# EasyEDA Pro project ProPrj_电力电子综合设计_2025-07-04.epro, board PCB1_2
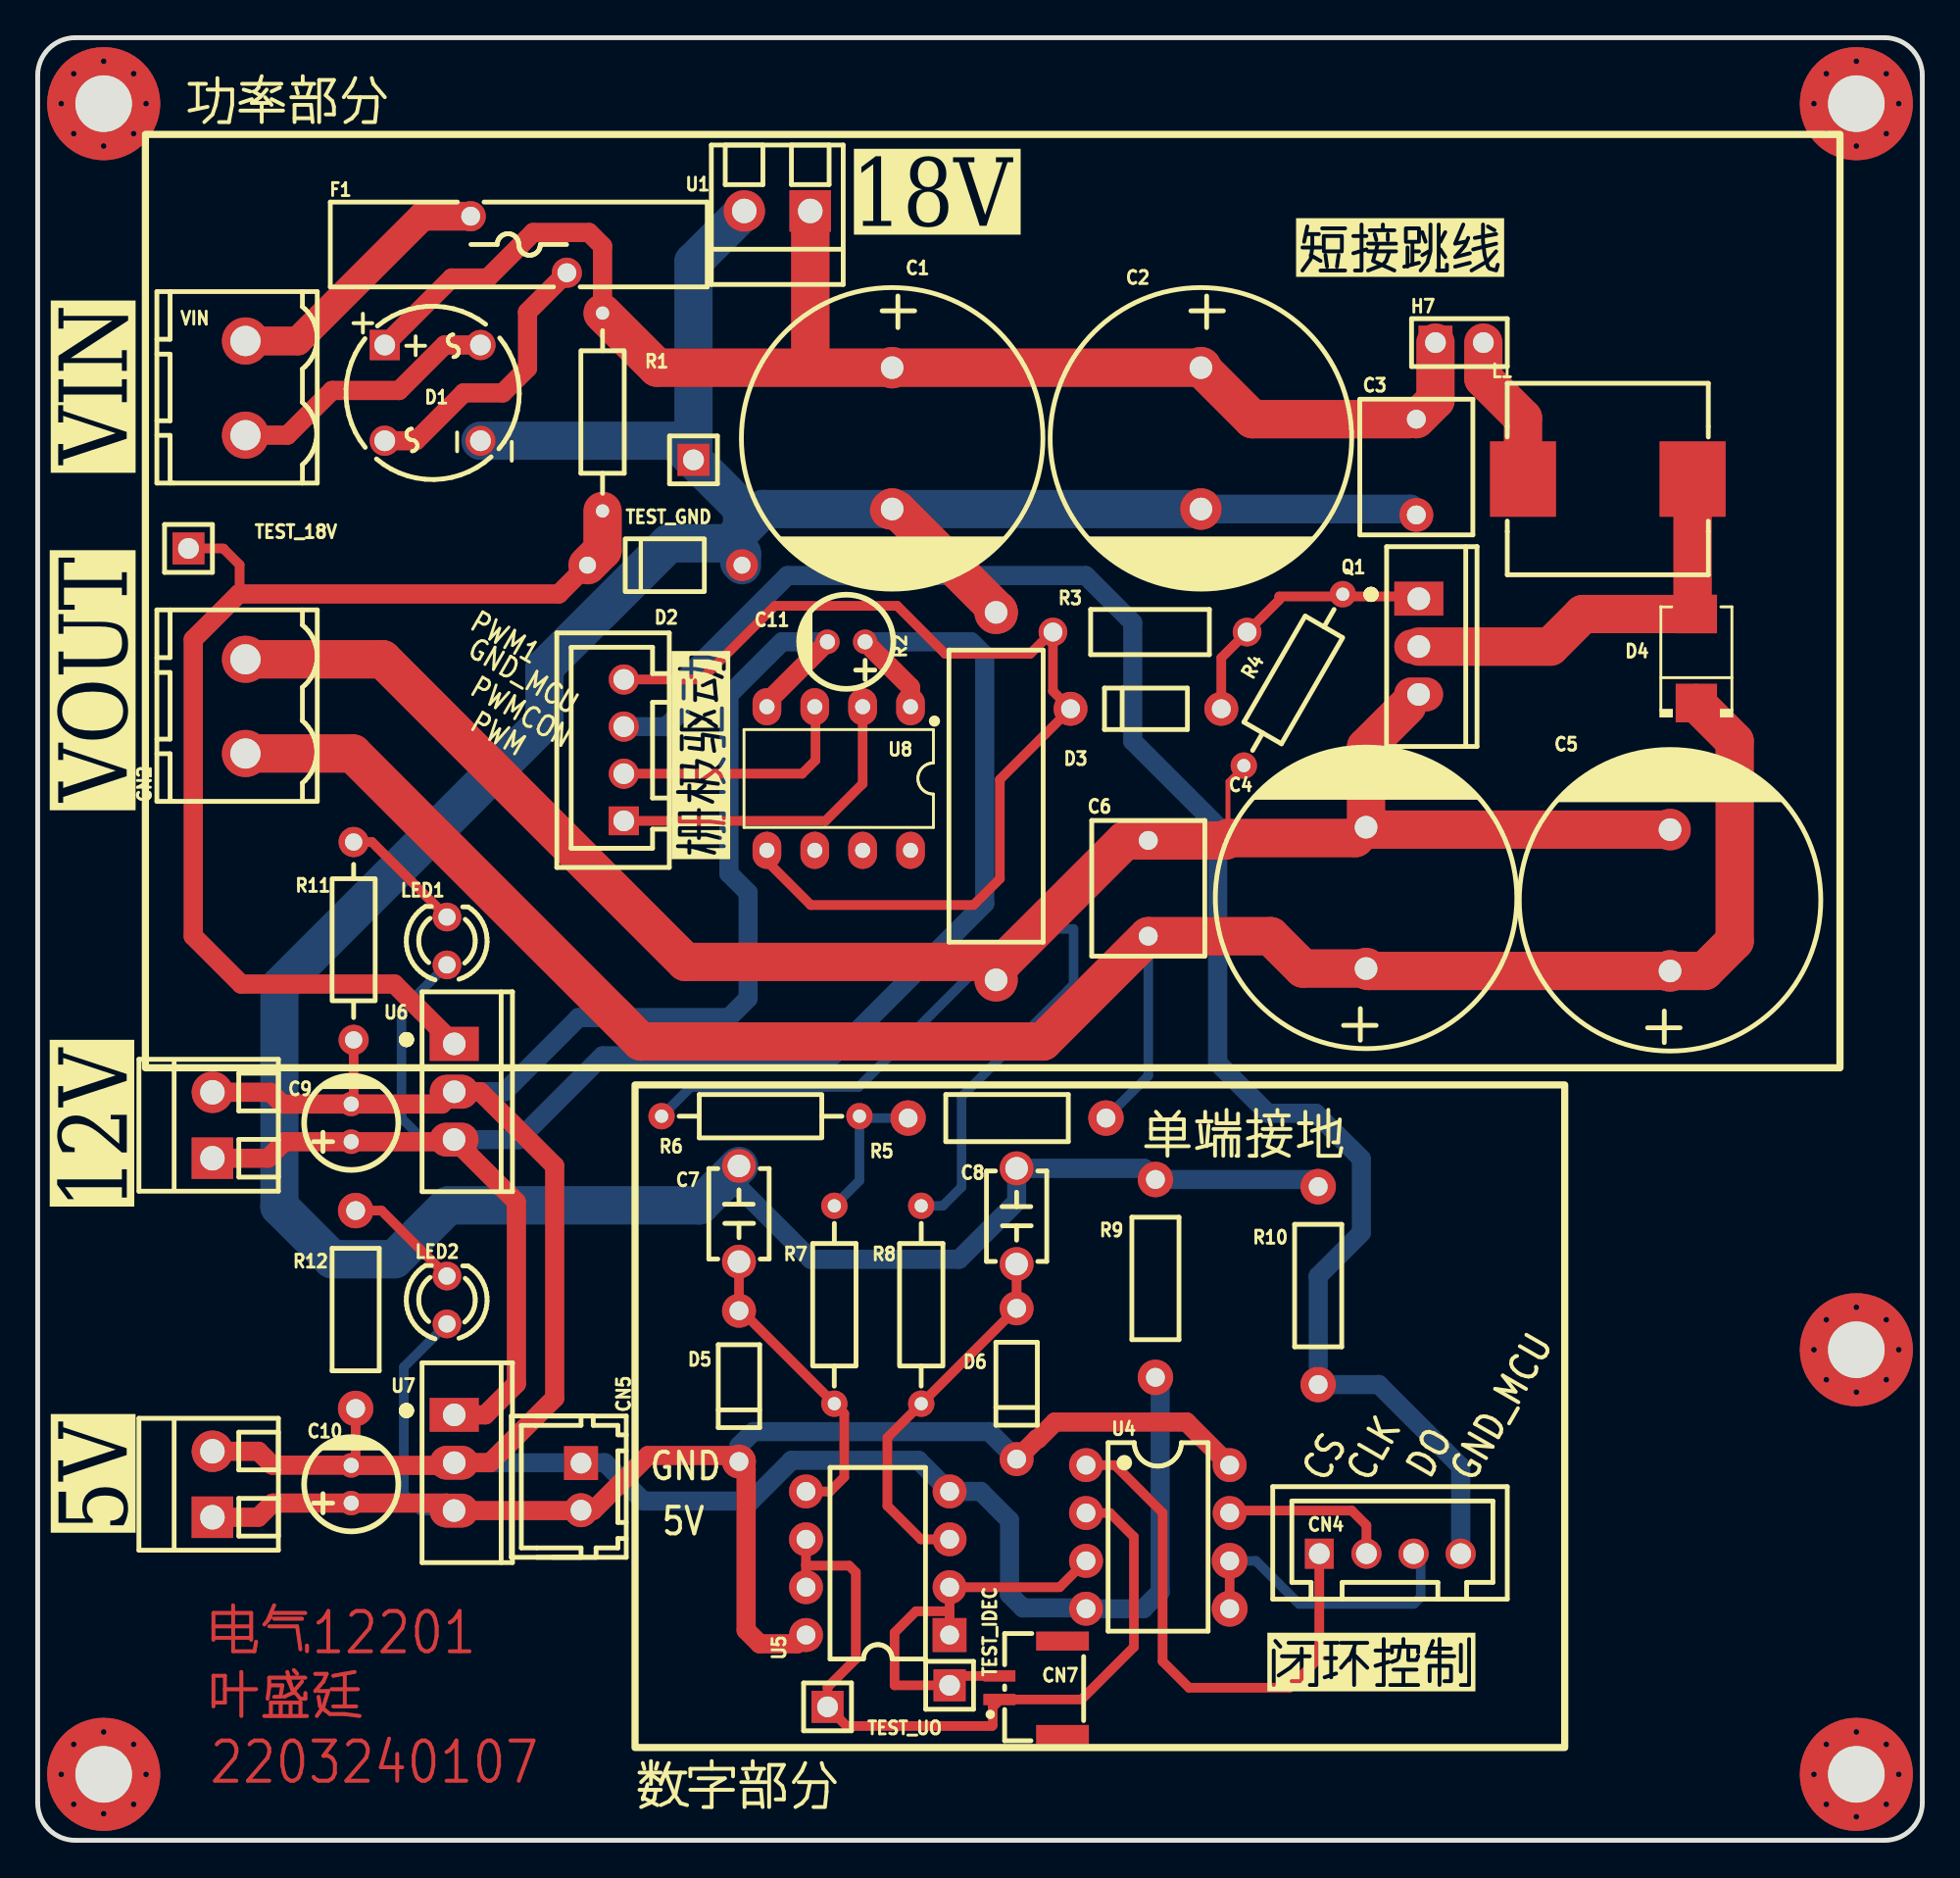
[diagram p7: board, top side]
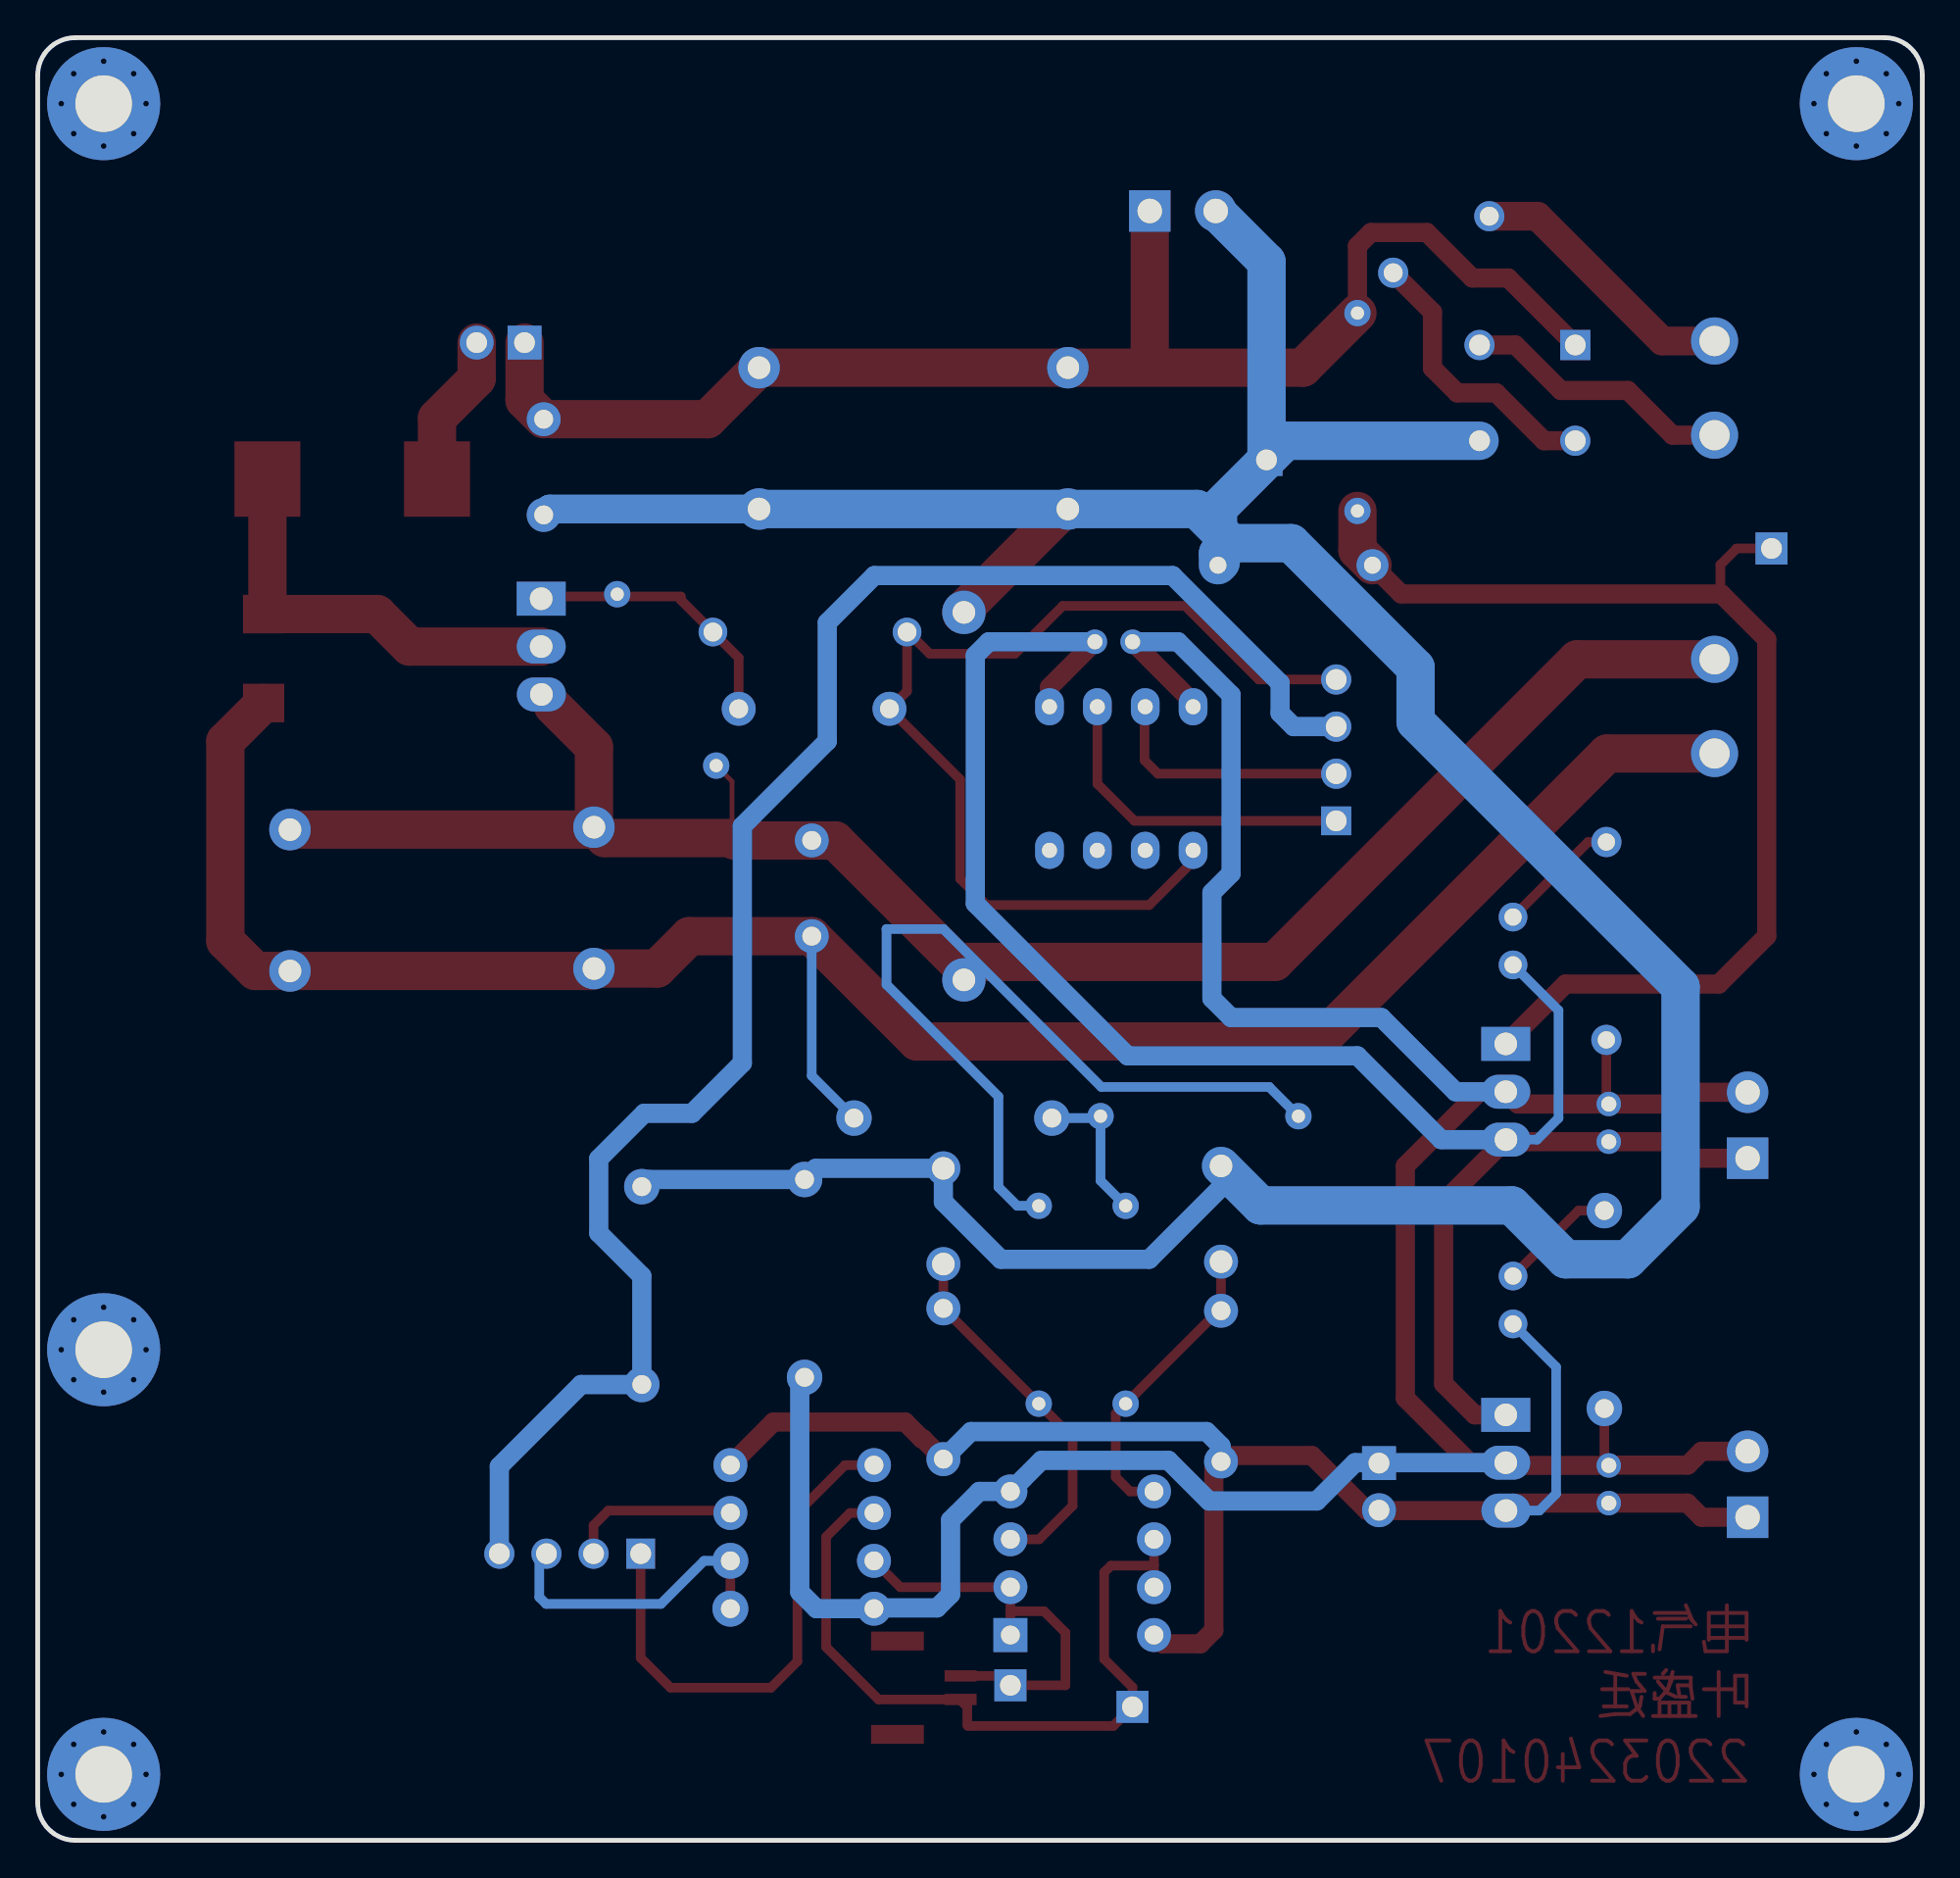
[diagram p8: board, bottom side, seen from below]

Outline 100 x 95.65 mm; copper layers: Top Layer, Bottom Layer. Coordinates in mm from the lower left corner of the outline.
Outline path: 0,93.65 0,2 arc(0.59,0.59) 2,0 98,0 arc(99.41,0.59) 100,2 100,93.65 arc(99.41,95.07) 98,95.65 2,95.65 arc(0.59,95.07) 0,93.65
Stack: Top Layer 0.035mm / Dielectric1 1.51mm FR4 er 4.5 / Bottom Layer 0.035mm

## Design rules (mm)
template: 自定义配置
spacing copperThickness1oz (default): track to track 0.102, other pairs 0.152 to 0.3
spacing copperThickness2oz: track to track 0.203, other pairs 0.152 to 0.3
track width copperThickness1oz (default): min 0.127, default 0.254, max 2.54
track width copperThickness2oz: min 0.203, default 0.254, max 2.54
differential pair differentialPair (default): width min 0.127, default 0.254, max 2.54; gap min 0.152, default 0.152
via viaSize (default): diameter min 0.406, default 0.406, max 10; hole min 0.305, default 0.305, max 6.299

## Placement (name value [footprint] x y rotation side)
C1  470uF  [CAP-TH_BD16.0-P7.50-D1.2-FD]  45.34 74.39 270 top
C2  470uF  [CAP-TH_BD16.0-P7.50-D1.2-FD]  61.72 74.39 270 top
C3  1uF  [CAP-TH_L7.2-W6.0-P5.00-D0.6]  73.15 72.87 90 top
C4  470uF  [CAP-TH_BD16.0-P7.50-D1.2-FD]  70.48 50.01 90 top
C5  470uF  [CAP-TH_BD16.0-P7.50-D1.2-FD]  86.61 49.88 90 top
C6  1uF  [CAP-TH_L7.2-W6.0-P5.00-D0.6]  58.93 50.52 270 top
C7  100nF  [CAP-TH_L4.8-W3.2-P5.08-D1.2]  37.21 33.24 270 top
C8  100nF  [CAP-TH_L4.8-W3.2-P5.08-D1.2]  51.94 33.12 270 top
C9  10uF  [CAP-TH_BD5.0-P2.00-D0.8-FD]  16.64 38.07 90 top
C10  10uF  [CAP-TH_BD5.0-P2.00-D0.8-FD]  16.64 18.89 90 top
C11  10uF  [CAP-TH_BD5.0-P2.00-D0.8-FD]  42.9 63.6 180 top
CN2  WJ2EDGV-5.08-2P  [CONN-TH_WJ2EDGV-5.08-2P]  11.02 60.17 90 top
CN3  ZX-XH2.54-4PZZ  [CONN-TH_4P-P2.50_4PIN]  31.1 57.85 90 top
CN4  ZX-XH2.54-4PZZ  [CONN-TH_4P-P2.50_4PIN]  71.75 15.21 0 top
CN5  ZX-XH2.54-2PZZ  [CONN-TH_2P-P2.50_HX25003-2A]  28.83 18.77 270 top
CN7  WAFER-GH1.25-2PLB  [CONN-TH_2P-P1.25_XUNPU_WAFER-GH1.25-2PLB]  52.7 8.1 90 top
D1  2W10  [DIO-BG-TH_2W10]  20.95 76.8 0 top
D2  1N4746APF-M  [DO-41_BD2.8-L4.2-P8.20-D0.7-RD]  33.27 67.66 0 top
D3  1N4148  [DO-35_BD2.0-L4.0-P8.00-D0.5-FD]  58.8 60.04 180 top
D4  SS310B  [SMB_L4.6-W3.6-LS5.3-RD]  88.01 62.71 90 top
D5  1N4148  [DO-35_BD2.0-L4.0-P8.00-D0.5-FD]  37.21 24.1 270 top
D6  1N4148  [DO-35_BD2.0-L4.0-P8.00-D0.5-FD]  51.94 24.23 270 top
F1  JK250-1000U  [FUSE-TH_L20.0-W4.5-P5.10-D0.8-S3.00]  25.53 84.68 0 top
H7  -  [HDR-TH_2P-P2.54-V-M-1]  75.44 79.47 0 top
L1  100uH  [IND-SMD_L10.6-W10.2]  83.31 72.23 0 top
LED1  204-10SUGD/S400-A5  [LED-TH_BD3.0-P2.54-FD-GREEN]  21.72 47.72 90 top
LED2  204-10SUGD/S400-A5  [LED-TH_BD3.0-P2.54-FD-GREEN]  21.72 28.67 90 top
NOREF  -  [Pad_e50]  96.5 92.15 270 top
NOREF#2  -  [Pad_e119]  3.5 3.5 90 top
NOREF#3  -  [Pad_e41]  3.5 92.15 0 top
NOREF#4  -  [Pad_e1739]  96.5 26.03 0 top
NOREF#5  -  [Pad_e109]  96.5 3.5 180 top
Q1  IRF540NPBF  [TO-220-3_L10.0-W4.5-P2.54-L]  73.28 63.34 270 top
R1  510Ω  [RES-TH_BD2.3-L6.5-P10.50-D0.5]  29.97 75.79 90 top
R2  100mΩ  [RES-TH_BD5.0-L15.5-P19.50-D0.7]  50.85 55.41 270 top
R3  10Ω  [RES-TH_BD2.4-L6.3-P10.30-D0.6]  59.02 64.11 0 top
R4  10kΩ  [RES-TH_BD2.3-L6.5-P10.50-D0.5]  66.62 61.57 60 top
R5  100kΩ  [RES-TH_BD2.5-L6.5-P10.50-D0.6]  51.44 38.32 0 top
R6  10kΩ  [RES-TH_BD2.3-L6.5-P10.50-D0.5]  38.35 38.42 0 top
R7  10kΩ  [RES-TH_BD2.3-L6.5-P10.50-D0.5]  42.27 28.42 270 top
R8  10kΩ  [RES-TH_BD2.3-L6.5-P10.50-D0.5]  46.88 28.42 270 top
R9  0Ω  [RES-TH_BD2.5-L6.5-P10.50-D0.6]  59.31 29.81 90 top
R10  0Ω  [RES-TH_BD2.5-L6.5-P10.50-D0.6]  67.94 29.43 270 top
R11  6.2kΩ  [RES-TH_BD2.2-L6.5-P10.50-D0.6]  16.76 47.72 90 top
R12  2.7kΩ  [RES-TH_BD2.5-L6.5-P10.50-D0.6]  16.87 28.16 90 top
TEST_18V  PZ254V-11-01P  [HDR-TH_1P-P2.54-V-M]  8 68.55 0 top
TEST_GND  PZ254V-11-01P  [HDR-TH_1P-P2.54-V-M]  34.8 73.25 0 top
TEST_IDEC  PZ254V-11-01P  [HDR-TH_1P-P2.54-V-M]  48.39 8.22 0 top
TEST_UO  PZ254V-11-01P  [HDR-TH_1P-P2.54-V-M]  41.91 7.08 0 top
U1  DB125-3.5-2P-GN-S  [CONN-TH_2P-P3.50_L7.4-W7.0]  39.24 86.46 180 top
U4  ADC0832CCN/NOPB  [PDIP-8_L9.6-W6.4-P2.54-LS7.6-BL]  59.44 16.1 270 top
U5  LM358AP  [DIP-8_L9.7-W6.4-P2.54-LS7.6-BL]  44.58 14.7 90 top
U6  L7812CV  [TO-220-3_L10.0-W4.5-P2.54-L]  22.1 39.72 270 top
U7  L7805CV  [TO-220-3_L10.0-W4.5-P2.54-L]  22.1 20.04 270 top
U8  IR2104PBF  [DIP-8_L9.9-W6.6-P2.54-LS7.62-BL]  42.5 56.34 180 top
U9  DB125-3.5-2P-GN-S  [CONN-TH_2P-P3.50_L7.4-W7.0]  9.27 37.94 90 top
U10  DB125-3.5-2P-GN-S  [CONN-TH_2P-P3.50_L7.4-W7.0]  9.27 18.89 90 top
VIN  WJ2EDGV-5.08-2P  [CONN-TH_WJ2EDGV-5.08-2P]  11.02 77.06 90 top

## Footprints (pads in the part's own frame, mm; a bottom-side part is the same pattern mirrored in y, then rotated)
CAP-TH_BD5.0-P2.00-D0.8-FD
  round 1.3 hole 0.8: 1(-1,0) 2(1,0)
CAP-TH_BD16.0-P7.50-D1.2-FD
  round 2.2 hole 1.2: 1(-3.75,0) 2(3.75,0)
CAP-TH_L4.8-W3.2-P5.08-D1.2
  round 1.8 hole 1.2: 1(-2.54,0) 2(2.54,0)
CAP-TH_L7.2-W6.0-P5.00-D0.6
  round 1.8 hole 1: 1(-2.54,0) 2(2.54,0)
CONN-TH_2P-P1.25_XUNPU_WAFER-GH1.25-2PLB
  rect 0.6x1.7 smd: 1(-0.625,1.675) 2(0.625,1.675)
  rect 1x2.8 smd: 3(2.475,-1.675) 4(-2.475,-1.675)
CONN-TH_2P-P2.50_HX25003-2A
  rect 1.8x1.8 hole 1.1: 1(-1.25,0)
  round 1.8 hole 1.1: 2(1.25,0)
CONN-TH_2P-P3.50_L7.4-W7.0
  rect 2.2x2.2 hole 1.3: 1(-1.75,0)
  round 2.2 hole 1.3: 2(1.75,0)
CONN-TH_4P-P2.50_4PIN
  rect 1.524x1.6 hole 1.1: 1(-3.75,0)
  round 1.6 hole 1.1: 2(-1.25,0) 3(1.25,0) 4(3.75,0)
CONN-TH_WJ2EDGV-5.08-2P
  round 2.5 hole 1.6: 1(-2.499,0) 2(2.499,0)
DIO-BG-TH_2W10
  rect 1.6x1.6 hole 1.1: 1(-2.54,2.54)
  round 1.6 hole 1.1: 2(-2.54,-2.54) 3(2.54,-2.54) 4(2.54,2.54)
DIP-8_L9.7-W6.4-P2.54-LS7.6-BL
  rect 1.8x1.8 hole 1: 1(-3.81,-3.81)
  round 1.8 hole 1: 2(-1.27,-3.81) 3(1.27,-3.81) 4(3.81,-3.81) 5(3.81,3.81) 6(1.27,3.81) 7(-1.27,3.81) 8(-3.81,3.81)
DIP-8_L9.9-W6.6-P2.54-LS7.62-BL
  oval 1.524x1.97 hole 0.8: 1(-3.81,-3.81) 2(-1.27,-3.81) 3(1.27,-3.81) 4(3.81,-3.81) 5(3.81,3.81) 6(1.27,3.81) 7(-1.27,3.81) 8(-3.81,3.81)
DO-35_BD2.0-L4.0-P8.00-D0.5-FD
  round 1.8 hole 1: 1(-4,0) 2(4,0)
DO-41_BD2.8-L4.2-P8.20-D0.7-RD
  round 1.7 hole 0.9: 1(-4.1,0) 2(4.1,0)
FUSE-TH_L20.0-W4.5-P5.10-D0.8-S3.00
  round 1.6 hole 1: 1(-2.55,1.5) 2(2.55,-1.5)
HDR-TH_1P-P2.54-V-M
  rect 1.7x1.7 hole 1.1: 1(0,0)
HDR-TH_2P-P2.54-V-M-1
  rect 1.8x1.8 hole 1.1: 1(-1.27,0)
  round 1.8 hole 1.1: 2(1.27,0)
IND-SMD_L10.6-W10.2
  rect 3.5x4 smd: 1(-4.5,0) 2(4.5,0)
LED-TH_BD3.0-P2.54-FD-GREEN
  round 1.524 hole 0.914: 1(-1.27,0) 2(1.27,0)
Pad_e41
  round 6 hole 3: 1(0,0)
Pad_e50
  round 6 hole 3: 1(0,0)
Pad_e109
  round 6 hole 3: 1(0,0)
Pad_e119
  round 6 hole 3: 1(0,0)
Pad_e1739
  round 6 hole 3: 1(0,0)
PDIP-8_L9.6-W6.4-P2.54-LS7.6-BL
  round 1.8 hole 1: 1(-3.81,-3.81) 2(-1.27,-3.81) 3(1.27,-3.81) 4(3.81,-3.81) 7(-1.27,3.81) 8(-3.81,3.81)
  round 1.905 hole 1: 5(3.81,3.81) 6(1.27,3.81)
RES-TH_BD2.2-L6.5-P10.50-D0.6
  round 1.6 hole 0.914: 1(-5.25,0) 2(5.25,0)
RES-TH_BD2.3-L6.5-P10.50-D0.5
  round 1.4 hole 0.7: 1(-5.25,0) 2(5.25,0)
RES-TH_BD2.4-L6.3-P10.30-D0.6
  round 1.524 hole 1: 1(-5.15,0) 2(5.15,0)
RES-TH_BD2.5-L6.5-P10.50-D0.6
  round 1.879 hole 1: 1(-5.25,0) 2(5.25,0)
RES-TH_BD5.0-L15.5-P19.50-D0.7
  round 2.3 hole 1.2: 1(-9.75,0) 2(9.75,0)
SMB_L4.6-W3.6-LS5.3-RD
  rect 2.047x2.192 smd: 1(-2.361,0) 2(2.361,0)
TO-220-3_L10.0-W4.5-P2.54-L
  rect 1.8x2.6 hole 1.2: 1(-2.54,0.005)
  oval 1.8x2.6 hole 1.2: 2(0,0.005) 3(2.54,-0.005)

## Nets
As in the schematic.

Pads without a net: CN7 3 4; NOREF 1; NOREF#2 1; NOREF#3 1; NOREF#4 1; NOREF#5 1; U8 6 7 8

## Via types
v1: diameter 0.406, hole 0.305, Top Layer to Bottom Layer, 40 vias

## Routing (per net, layer and track width the routed paths; a pad name or vN(x,y) marks a point on that pad's centre or on a via; arc(x,y) is an arc through that point)
+5V: length 85.1
  Top Layer w1.016: D6.2 53.02,21.31 53.09,21.31 53.97,22.19 60.96,22.19 U4.8 ; U5.8 40.3,10.43 38.31,10.43 37.59,11.15 37.59,19.72 36.89,20.42 32.38,20.42 29.46,17.5 22.09,17.5 21.7,17.89 C10.1 12.46,17.89 11.71,17.14 U10.1
  Bottom Layer w0.508: 22.09,17.5 20.32,17.5 19.43,18.38 19.43,25.12 LED2.1
  Bottom Layer w1.016: D6.2 50.48,21.69 37.97,21.69 37.21,20.92 D5.2
+12V: length 101.5
  Top Layer w1.016: U8.1 46.31,61.19 C11.1 ; U7.1 23.75,22.58 25.4,24.23 25.4,33.87 22.09,37.18 21.98,37.07 C9.1 13.1,37.07 12.22,36.19 U9.1
  Bottom Layer w0.508: 22.09,37.18 20.45,37.18 19.3,38.32 19.3,44.04 LED1.1
  Bottom Layer w1.016: 22.09,37.18 25.53,37.18 29.97,41.63 42.16,41.63 50.25,49.71 50.25,62.88 49.53,63.6 C11.1
+18V: length 62.3
  Top Layer w0.508: 10.72,66.14 10.72,67.68 9.87,68.53 ; TEST_18V.1 9.87,68.55
  Top Layer w1.016: U6.1 18.93,45.44 10.79,45.44 8.25,47.98 8.25,63.72 10.67,66.14 27.65,66.14 D2.1
  Top Layer w2.032: R1.1 29.97,68.46 D2.1
AGND: length 161.2
  Top Layer w0.508: R12.1 16.87,20.13 C10.2 ; 16.64,38.83 16.76,38.96 R11.1
  Top Layer w1.016: U8.4 38.69,60.39 C11.2 ; U10.2 11.71,20.64 12.45,19.91 16.62,19.91 C10.2 21.96,19.89 U7.2 24,20.04 27.43,23.47 27.43,35.78 23.49,39.72 U6.2 21.45,39.07 16.76,39.07 ; U9.2 12.35,39.69 12.97,39.07 C9.2
  Bottom Layer w1.016: R9.1 59.56,24.31 59.56,13.18 58.67,12.29 U4.4 55.58,12.33 52.28,12.33 51.56,13.05 51.56,16.99 50.04,18.51 U5.4 46.74,20.16 40,20.16 37.85,18 32.13,18 30.1,20.04 U7.2 ; U6.2 24.77,39.72 28.7,43.66 36.68,43.66 37.69,44.67 37.69,50.29 36.68,51.3 36.68,60.78 39.5,63.6 C11.2
GND: length 189.7
  Top Layer w2.032: 45.18,70.59 45.6,70.59 50.98,65.21 50.98,65.07
  Bottom Layer w1.016: C7.1 37.21,34.64 41.02,30.83 48.89,30.83 51.94,33.88 51.94,35.28 ; C8.1 58.72,35.66 R9.2 67.56,35.06 R10.1
  Bottom Layer w1.524: C2.2 72.84,70.64 C3.1 ; 37.23,67.81 D2.2
  Bottom Layer w2.032: 36.68,68.83 33.49,68.83 26.89,62.23 26.89,59.35 12.83,45.29 12.83,33.62 15.62,30.83 18.92,30.83 21.78,33.69 35.12,33.69 C7.1 ; 36.68,68.83 37.23,68.28 ; 36.68,68.83 37.37,69.52 ; C2.2 C1.2 38.49,70.64 37.37,69.52 ; TEST_GND.1 33.78,74.27 D1.3 ; TEST_GND.1 34.8,83.76 U1.2 ; TEST_GND.1 37.37,70.67 37.37,69.52 ; 37.23,68.28 37.37,68.28 D2.2 ; 37.23,68.28 37.23,67.81
GND_MCU: length 94.2
  Bottom Layer w1.016: CN4.4 75.5,19.84 71.16,24.18 R10.2 67.94,29.94 70.23,32.23 70.23,36.16 67.82,38.58 65.28,38.58 62.61,41.24 62.61,53.82 58.1,58.32 58.1,64.61 55.61,67.11 39.78,67.11 34.08,61.41 34.08,59.81 33.36,59.1 CN3.3
VIN: length 75.6
  Top Layer w1.016: R1.2 29.97,84.6 29.25,85.31 26.29,85.31 23.88,82.9 21.97,82.9 D1.1
  Top Layer w2.032: C3.2 74.17,76.42 H7.1 ; U1.1 40.99,78.33 ; R1.2 32.87,78.14 C1.1 C2.1 64.46,75.41 72.77,75.41
(no net):
  vias: v1(1.25,92.15) v1(1.25,3.5) v1(1.91,93.74) v1(1.91,90.56) v1(1.91,5.09) v1(1.91,1.91) v1(3.5,94.4) v1(3.5,89.9) v1(3.5,5.75) v1(3.5,1.41) v1(5.09,93.74) v1(5.09,90.56) v1(5.09,5.09) v1(5.09,1.91) v1(5.75,92.15) v1(5.75,3.5) v1(94.25,92.15) v1(94.25,26.03) v1(94.25,3.5) v1(94.91,93.74) v1(94.91,90.56) v1(94.91,27.62) v1(94.91,24.44) v1(94.91,5.09) v1(94.91,1.91) v1(96.5,94.4) v1(96.5,89.9) v1(96.5,28.28) v1(96.5,23.78) v1(96.5,5.75) v1(96.5,1.25) v1(98.09,93.74) v1(98.09,90.56) v1(98.09,27.62) v1(98.09,24.44) v1(98.09,5.09) v1(98.09,1.91) v1(98.75,92.15) v1(98.75,26.03) v1(98.75,3.5)
AC_L: length 15.1
  Top Layer w1.016: D1.2 20.07,74.27 22.61,76.8 24.68,76.8 25.99,78.12 25.99,81.09 F1.2
AC_N: length 13.8
  Top Layer w1.016: D1.4 21.59,79.34 19.18,76.93 15.62,76.93 13.25,74.56 11.68,74.56
CLK: length 9.1
  Top Layer w0.508: U4.7 63.37,17.5 69.72,17.5 70.5,16.71 CN4.2
CS: length 28.1
  Top Layer w0.508: U4.1 57.16,19.91 59.69,17.38 59.69,9.5 61.09,8.1 66.42,8.1 68,9.68 CN4.1
DO: length 16.2
  Top Layer w0.508: U4.5 U4.6
  Bottom Layer w0.508: U4.6 64.64,14.83 66.93,12.54 73.03,12.54 73.38,12.9 73.38,14.83 CN4.3
IDEC: length 142.3
  Top Layer w0.254: 63.16,53.18 63.16,56.19 64,57.03
  Top Layer w1.524: 72.66,60.19 Q1.3
  Top Layer w2.032: C4.2 69.91,53.18 63.16,53.18 63.03,53.06 C6.1 57.69,53.06 51.24,46.61 34.37,46.61 18.31,62.67 CN2.2 ; C4.2 70.48,58.01 72.66,60.19 ; C4.2 70.61,53.63 C5.2
  Bottom Layer w0.508: R8.1 48.03,33.67 49.02,34.66 49.02,39.47 54.96,45.41 54.96,48.36 51.94,48.36 43.56,39.97 34.66,39.97 R6.1
PWM: length 17.6
  Top Layer w0.508: U8.2 43.77,56.06 41.81,54.1 CN3.1
PWM1: length 55.4
  Top Layer w0.508: U8.5 38.69,51.95 41.02,49.63 49.66,49.63 51.05,51.02 51.05,56.29 D3.2 53.87,60.97 R3.1 53.8,64.11 ; CN3.4 35.21,61.6 39.12,65.5 45.6,65.5 48.15,62.96 52.67,62.96 53.8,64.09
PWMCON: length 13.3
  Top Layer w0.508: CN3.2 40.56,56.6 41.27,57.31 41.27,60.11 U8.3
SW: length 22.7
  Top Layer w2.032: Q1.2 80.26,63.34 81.99,65.07 D4.2 87.81,65.27 L1.2
TEST_IDEC: length 22.3
  Top Layer w0.508: CN7.2 48.88,8.72 TEST_IDEC.1 45.47,8.22 45.47,11.02 46.6,12.16 48.39,12.16 ; 48.39,12.16 U5.1 ; 48.39,12.16 U5.2 54.23,13.43 U4.3
TEST_UO: length 41.1
  Top Layer w0.508: U5.6 40.77,14.6 ; 40.77,14.6 U5.7 ; 40.77,14.6 40.8,14.57 43.05,14.57 43.41,14.22 43.41,9.62 41.91,8.12 TEST_UO.1 42.93,6.07 50.63,6.07 50.67,6.1 50.67,7.07 51.05,7.45 ; 50.96,7.51 51,7.47 55.38,7.47 58.17,10.26 58.17,16.1 56.9,17.37 U4.2
UO: length 7.9
  Bottom Layer w0.508: R7.1 43.6,35 R6.2 43.7,38.32 R5.1
VOUT: length 113.1
  Top Layer w2.032: CN2.1 16.72,57.67 32,42.39 53.34,42.39 58.93,47.98 65.42,47.98 67.14,46.26 C4.1 70.61,46.13 C5.1 88.45,46.13 90.04,47.72 90.04,58.32 D4.1
  Bottom Layer w0.508: 58.93,47.98 58.93,40.57 R5.2
$1N366: length 14
  Top Layer w1.524: F1.1 20.42,86.18 13.8,79.56 11.68,79.56
$1N1800: length 8.1
  Top Layer w2.032: H7.2 76.71,77.57 78.81,75.46 L1.1
$1N2114: length 14.7
  Top Layer w0.508: D3.1 62.8,62.75 R3.2 65.88,65.82 65.88,66 73.17,66 Q1.1
$1N3292: length 16.2
  Top Layer w0.508: U5.5 42.04,18.51 42.8,19.27 42.8,22.64 R7.2 37.34,28.1 D5.1 C7.2
$1N4224: length 19.7
  Top Layer w0.508: D6.1 C8.2 ; 51.94,28.23 R8.2 45.09,21.37 45.09,17.75 46.86,15.97 U5.3
$1N5009: length 6.6
  Top Layer w0.508: LED1.2 17.74,52.97 R11.2
$1N5371: length 6.3
  Top Layer w0.508: LED2.2 18.24,33.41 R12.2

## Text on the board
Top Layer: 电气12201 / 叶盛廷 / 2203240107
Top Solder Mask Layer: 电气12201 / 叶盛廷 / 2203240107
Top Silkscreen Layer: GND_MCU | PWM1 | PWMCON | PWM | GND | 5V | CS | CLK | DO | 功率部分 | 数字部分 | 单端接地 | 短接跳线 | 栅极驱动 | 闭环控制 | 18V | VOUT | 12V | VIN
